# Altium project PCI_mez_to_MB.PrjPcb
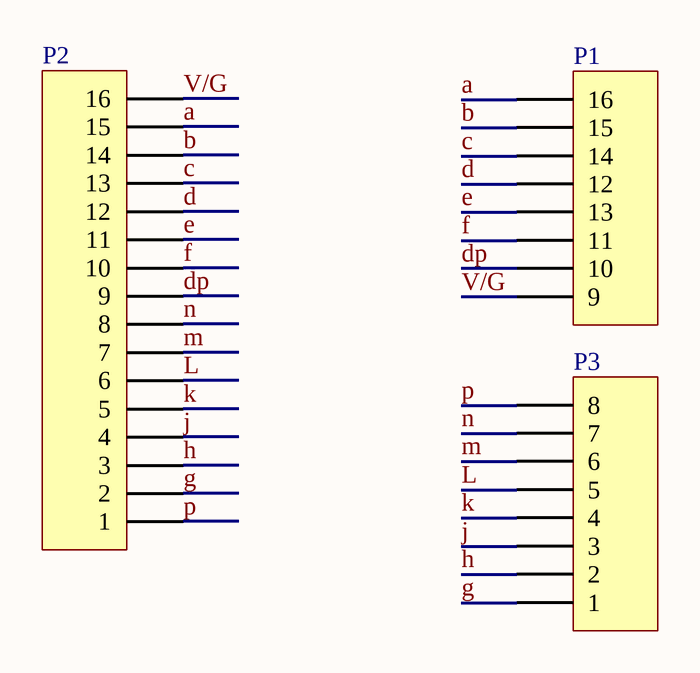
[diagram p0: Sheet1_PCI_mez_to_MB.SchDoc]
1 sheet, 3 parts. Net scope: global (net labels, ports and power ports of the same name join across sheets).
Board file: PCB_PCI_mez_to_MB.PcbDoc

## Sheet Sheet1_PCI_mez_to_MB.SchDoc
size A4 portrait; SheetNumber: 1; SheetTotal: 1

### Parts
P1  Header 8  [HDR1X8]  (value not drawn)
P2  Header 16  [HDR1X16]  (value not drawn)
P3  Header 8  [HDR1X8]  (value not drawn)

### Nets
a: P1.1(16) P2.15
b: P1.2(15) P2.14
c: P1.3(14) P2.13
d: P1.4(12) P2.12
dp: P1.7(10) P2.9
e: P1.5(13) P2.11
f: P1.6(11) P2.10
g: P2.2 P3.1
h: P2.3 P3.2
j: P2.4 P3.3
k: P2.5 P3.4
L: P2.6 P3.5
m: P2.7 P3.6
n: P2.8 P3.7
p: P2.1 P3.8
V/G: P1.8(9) P2.16

### Library data of the parts
P1 P3 = Header 8: Header, 8-Pin; LatestRevisionDate: 17-Jul-2002; LatestRevisionNote: Re-released for DXP Platform.; Publisher: Altium Limited
P2 = Header 16: Header, 16-Pin; LatestRevisionDate: 17-Jul-2002; LatestRevisionNote: Re-released for DXP Platform.; Publisher: Altium Limited